# EAGLE design RHButtonBoard (EAGLE 9.2.2)
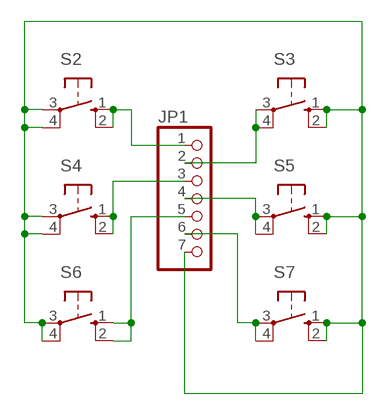
[diagram p0: schematic, sheet 1]

## Parts
JP1  PINHD-1X7  [1X07]
S2  10-XX  [B3F-10XX]
S3  10-XX  [B3F-10XX]
S4  10-XX  [B3F-10XX]
S5  10-XX  [B3F-10XX]
S6  10-XX  [B3F-10XX]
S7  10-XX  [B3F-10XX]

## Nets
N$1: JP1.1 S2.1(S) S2.2(S1)
N$2: JP1.2 S3.3(P) S3.4(P1)
N$3: JP1.3 S4.1(S) S4.2(S1)
N$4: JP1.4 S5.3(P) S5.4(P1)
N$5: JP1.5 S6.1(S) S6.2(S1)
N$6: JP1.6 S7.3(P) S7.4(P1)
N$7: JP1.7 S2.3(P) S2.4(P1) S3.1(S) S3.2(S1) S4.3(P) S4.4(P1) S5.1(S) S5.2(S1) S6.3(P) S6.4(P1) S7.1(S) S7.2(S1)

## Library data of the parts
JP1 = pinhead:PINHD-1X7: PIN HEADER
S2-S7 = switch-omron:10-XX: OMRON SWITCH; MPN: B3F-1000; OC_FARNELL: 176432; OC_NEWARK: 36M3542

## Net classes
0 default: width 0.254 mm, clearance 0.203 mm

## Board
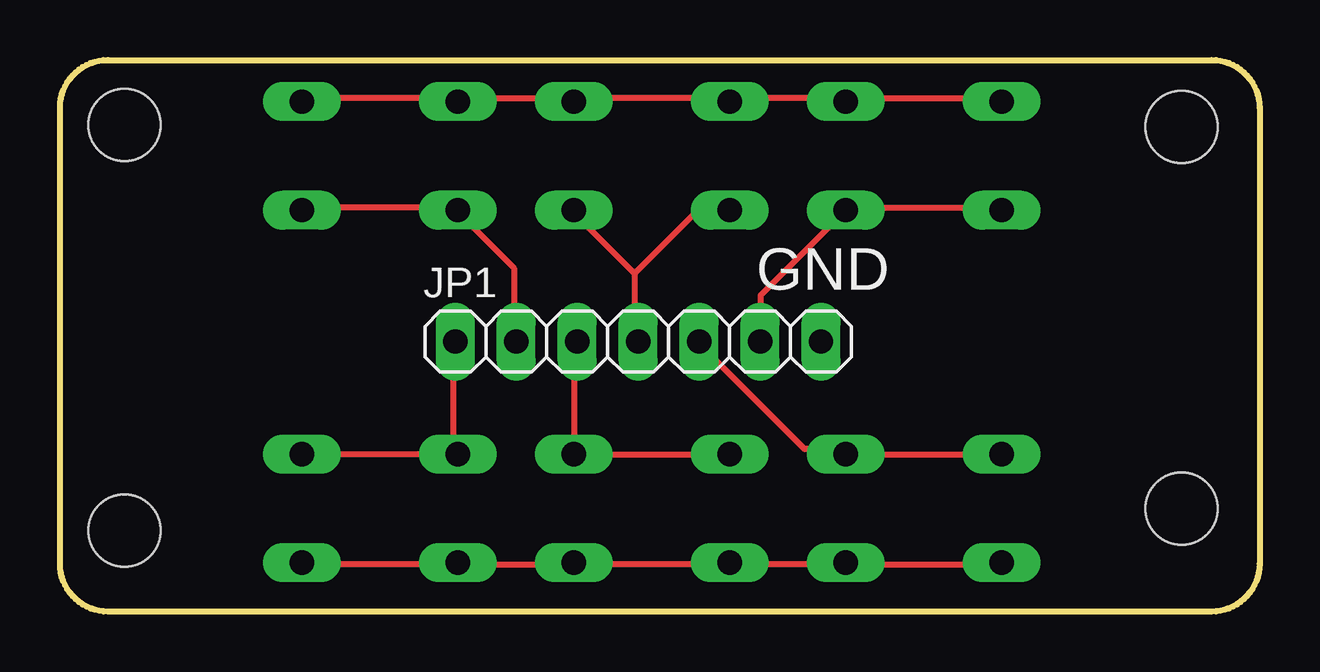
[diagram p1: board, top side]
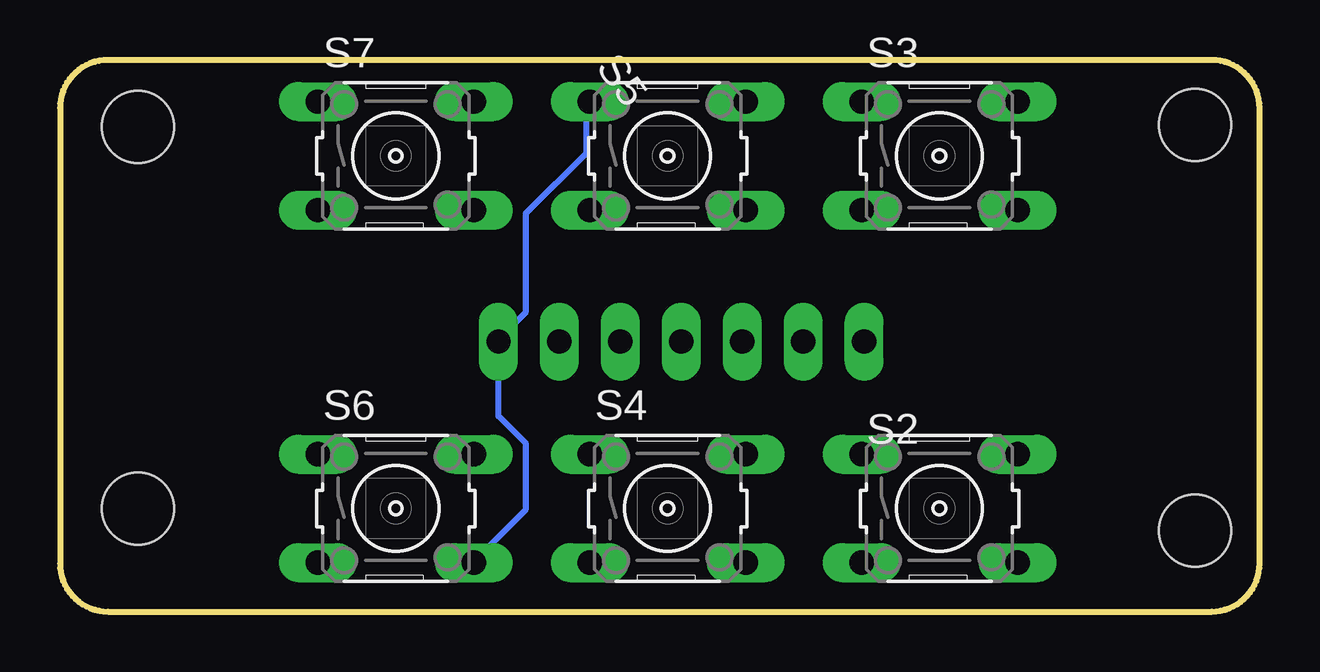
[diagram p2: board, bottom side, seen from below]

Size 50 x 23 mm. Coordinates in mm from the lower left corner, seen from the top.
Outline: 2,23 48,23 arc-90 50,21 50,2 arc-90 48,0 2,0 arc-90 0,2 0,21 arc-90 2,23
Copper layers (1*16): Top 0.035mm / dielectric 1.5mm / Bottom 0.035mm
Design rules "SparkFun": minimum track width 8mil, minimum drill 20mil, track to track 8mil, track to pad 8mil, pad to pad 8mil, via to via 8mil, smd to smd 8mil, copper to edge 8mil, drill to drill 8mil, minimum pad ring 12mil, minimum via ring 10mil, stop-mask expansion 4mil, vias tented up to drill 20mil, thermal gap 10mil
Holes 3 mm at 2.69,3.37 2.69,20.3 46.75,20.2 46.75,4.3

### Footprints (pad centres in the part's own frame; a part is rotated, then mirrored left to right if it is on the bottom)
1X07 = drill 1.016 long: 1 -7.62,0; 2 -5.08,0; 3 -2.54,0; 4 0,0; 5 2.54,0; 6 5.08,0; 7 7.62,0
B3F-10XX = drill 1.016 long: 1 -3.251,2.261; 2 3.251,2.261; 3 -3.251,-2.261; 4 3.251,-2.261

### Placement (x,y rotation side)
JP1  24.1,11.26 0 top
S2  13.34,4.3 0 bottom
S3  13.34,19 0 bottom
S4  24.67,4.3 0 bottom
S5  24.67,19 0 bottom
S6  36,4.3 0 bottom
S7  36,19 0 bottom

### Tracks (layer width: path | path; a pad name or v marks a point on that pad's centre or on a via)
N$1
  Top 0.254: S2.2 10.23,6.55 16.4,6.55 S2.1 16.4,6.78 16.4,11.12 JP1.1
N$2
  Top 0.254: JP1.2 18.92,11.35 18.92,14.32 16.63,16.61 S3.3 16.4,16.84 10.23,16.84 S3.4
N$3
  Top 0.254: JP1.3 21.43,11.12 21.43,6.78 S4.2 21.43,6.55 27.83,6.55 S4.1
N$4
  Top 0.254: 23.95,14.09 23.95,11.35 JP1.4 | 23.95,14.09 21.43,16.61 S5.4 | 23.95,14.09 26.46,16.61 27.83,16.61 S5.3
N$5
  Top 0.254: JP1.5 26.69,11.12 31.03,6.78 32.63,6.78 S6.2 32.86,6.55 39.03,6.55 S6.1
N$6
  Top 0.254: JP1.6 29.2,11.35 29.2,13.18 32.63,16.61 S7.4 32.86,16.84 39.03,16.84 S7.3
N$7
  Top 0.254: S3.2 10.23,21.41 16.4,21.41 S3.1 16.63,21.41 21.2,21.41 S5.2 21.43,21.41 27.83,21.41 S5.1 28.06,21.41 32.63,21.41 S7.2 32.86,21.41 39.03,21.41 S7.1 | S2.4 10.23,1.98 16.4,1.98 S2.3 16.63,1.98 21.2,1.98 S4.4 21.43,1.98 27.83,1.98 S4.3 28.06,1.98 32.63,1.98 S6.4 32.86,1.98 39.03,1.98 S6.3
  Bottom 0.254: S6.4 32.63,2.2 30.58,4.26 30.58,7.01 31.72,8.15 JP1.7 31.72,11.35 30.58,12.49 30.58,16.61 28.06,19.12 28.06,21.18 S5.1

### Text on the board
tPlace: GND